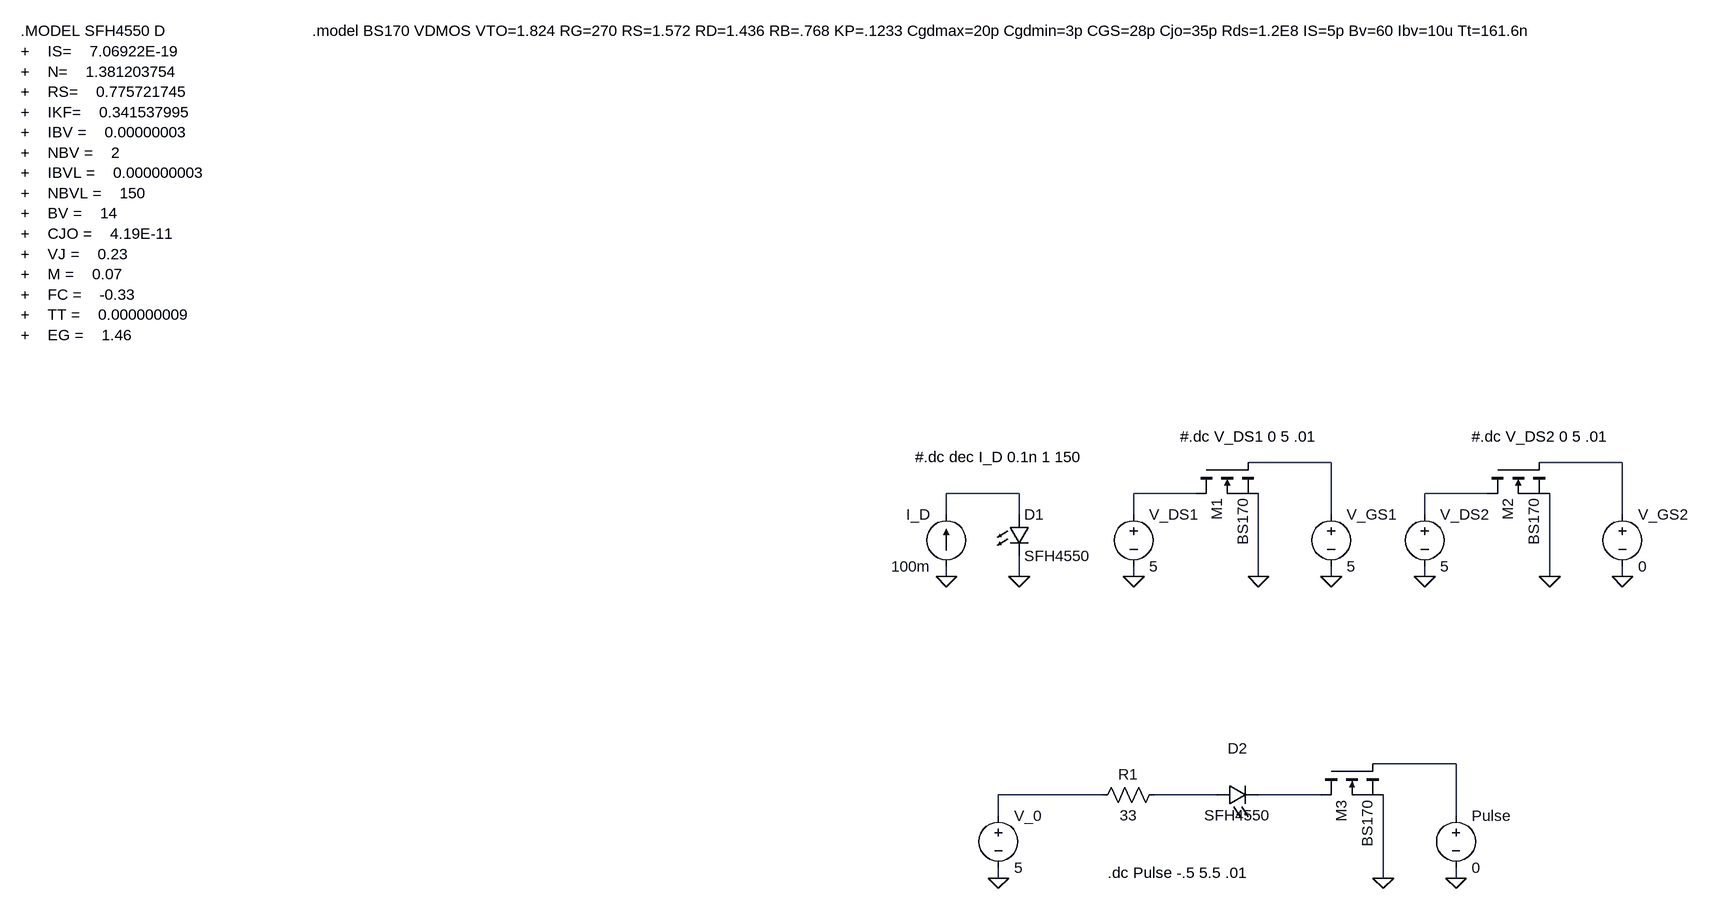
[diagram p0: schematic Circuit.asc]
Circuit.asc, the LTspice schematic file:
Version 4
SHEET 1 3460 2048
WIRE 1392 848 1264 848
WIRE 1840 848 1712 848
WIRE 912 896 800 896
WIRE 1184 896 1088 896
WIRE 1632 896 1536 896
WIRE 800 928 800 896
WIRE 912 928 912 896
WIRE 1088 928 1088 896
WIRE 1392 928 1392 848
WIRE 1536 928 1536 896
WIRE 1840 928 1840 848
WIRE 800 1024 800 1008
WIRE 912 1024 912 992
WIRE 1088 1024 1088 1008
WIRE 1280 1024 1280 896
WIRE 1392 1024 1392 1008
WIRE 1536 1024 1536 1008
WIRE 1728 1024 1728 896
WIRE 1840 1024 1840 1008
WIRE 1584 1312 1456 1312
WIRE 1040 1360 880 1360
WIRE 1216 1360 1120 1360
WIRE 1376 1360 1280 1360
WIRE 880 1392 880 1360
WIRE 1584 1392 1584 1312
WIRE 880 1488 880 1472
WIRE 1472 1488 1472 1360
WIRE 1584 1488 1584 1472
FLAG 1088 1024 0
FLAG 1392 1024 0
FLAG 1280 1024 0
FLAG 912 1024 0
FLAG 800 1024 0
FLAG 1536 1024 0
FLAG 1840 1024 0
FLAG 1728 1024 0
FLAG 880 1488 0
FLAG 1584 1488 0
FLAG 1472 1488 0
SYMBOL LED 1216 1376 R270
WINDOW 0 72 32 VTop 2
WINDOW 3 0 32 VBottom 2
SYMATTR InstName D2
SYMATTR Value SFH4550
SYMBOL res 1024 1376 R270
WINDOW 0 32 56 VTop 2
WINDOW 3 0 56 VBottom 2
SYMATTR InstName R1
SYMATTR Value 33
SYMBOL voltage 1088 912 R0
SYMATTR InstName V_DS1
SYMATTR Value 5
SYMBOL voltage 1392 912 R0
SYMATTR InstName V_GS1
SYMATTR Value 5
SYMBOL nmos 1184 848 M90
SYMATTR InstName M1
SYMATTR Value BS170
SYMBOL LED 896 928 R0
SYMATTR InstName D1
SYMATTR Value SFH4550
SYMBOL current 800 1008 R180
WINDOW 0 24 80 Left 2
WINDOW 3 24 0 Left 2
SYMATTR InstName I_D
SYMATTR Value 100m
SYMBOL voltage 1536 912 R0
SYMATTR InstName V_DS2
SYMATTR Value 5
SYMBOL voltage 1840 912 R0
SYMATTR InstName V_GS2
SYMATTR Value 0
SYMBOL nmos 1632 848 M90
SYMATTR InstName M2
SYMATTR Value BS170
SYMBOL voltage 880 1376 R0
SYMATTR InstName V_0
SYMATTR Value 5
SYMBOL voltage 1584 1376 R0
SYMATTR InstName Pulse
SYMATTR Value 0
SYMBOL nmos 1376 1312 M90
SYMATTR InstName M3
SYMATTR Value BS170
TEXT 1048 1480 Left 2 !.dc Pulse -.5 5.5 .01
TEXT -624 184 Left 2 !.MODEL SFH4550 D		\n+	IS=	7.06922E-19\n+	N=	1.381203754\n+	RS=	0.775721745\n+	IKF=	0.341537995\n+	IBV =	0.00000003\n+	NBV =	2\n+	IBVL =	0.000000003\n+	NBVL =	150\n+	BV =	14\n+	CJO =	4.19E-11\n+	VJ =	0.23\n+	M =	0.07\n+	FC =	-0.33\n+	TT =	0.000000009\n+	EG =	1.46
TEXT -176 184 Left 2 !.model BS170 VDMOS VTO=1.824 RG=270 RS=1.572 RD=1.436 RB=.768 KP=.1233 Cgdmax=20p Cgdmin=3p CGS=28p Cjo=35p Rds=1.2E8 IS=5p Bv=60 Ibv=10u Tt=161.6n
TEXT 1160 808 Left 2 !#.dc V_DS1 0 5 .01
TEXT 752 840 Left 2 !#.dc dec I_D 0.1n 1 150
TEXT 1608 808 Left 2 !#.dc V_DS2 0 5 .01

The netlist it stands for:
* Circuit.asc
D2 N008 N009 SFH4550
R1 N007 N008 33
V_DS1 N004 0 5
V_GS1 N001 0 5
M1 N004 N001 0 0 BS170
D1 N003 0 SFH4550
I_D 0 N003 100m
V_DS2 N005 0 5
V_GS2 N002 0 0
M2 N005 N002 0 0 BS170
V_0 N007 0 5
V§Pulse N006 0 0
M3 N009 N006 0 0 BS170
.model D D
.lib standard.dio
.model NMOS NMOS
.model PMOS PMOS
.lib standard.mos
.dc Pulse -.5 5.5 .01
.MODEL SFH4550 D
+	IS=	7.06922E-19
+	N=	1.381203754
+	RS=	0.775721745
+	IKF=	0.341537995
+	IBV =	0.00000003
+	NBV =	2
+	IBVL =	0.000000003
+	NBVL =	150
+	BV =	14
+	CJO =	4.19E-11
+	VJ =	0.23
+	M =	0.07
+	FC =	-0.33
+	TT =	0.000000009
+	EG =	1.46
.model BS170 VDMOS VTO=1.824 RG=270 RS=1.572 RD=1.436 RB=.768 KP=.1233 Cgdmax=20p Cgdmin=3p CGS=28p Cjo=35p Rds=1.2E8 IS=5p Bv=60 Ibv=10u Tt=161.6n
#.dc V_DS1 0 5 .01
#.dc dec I_D 0.1n 1 150
#.dc V_DS2 0 5 .01
.backanno
.end